# EAGLE design simpleclock_v1 (EAGLE 6.4)
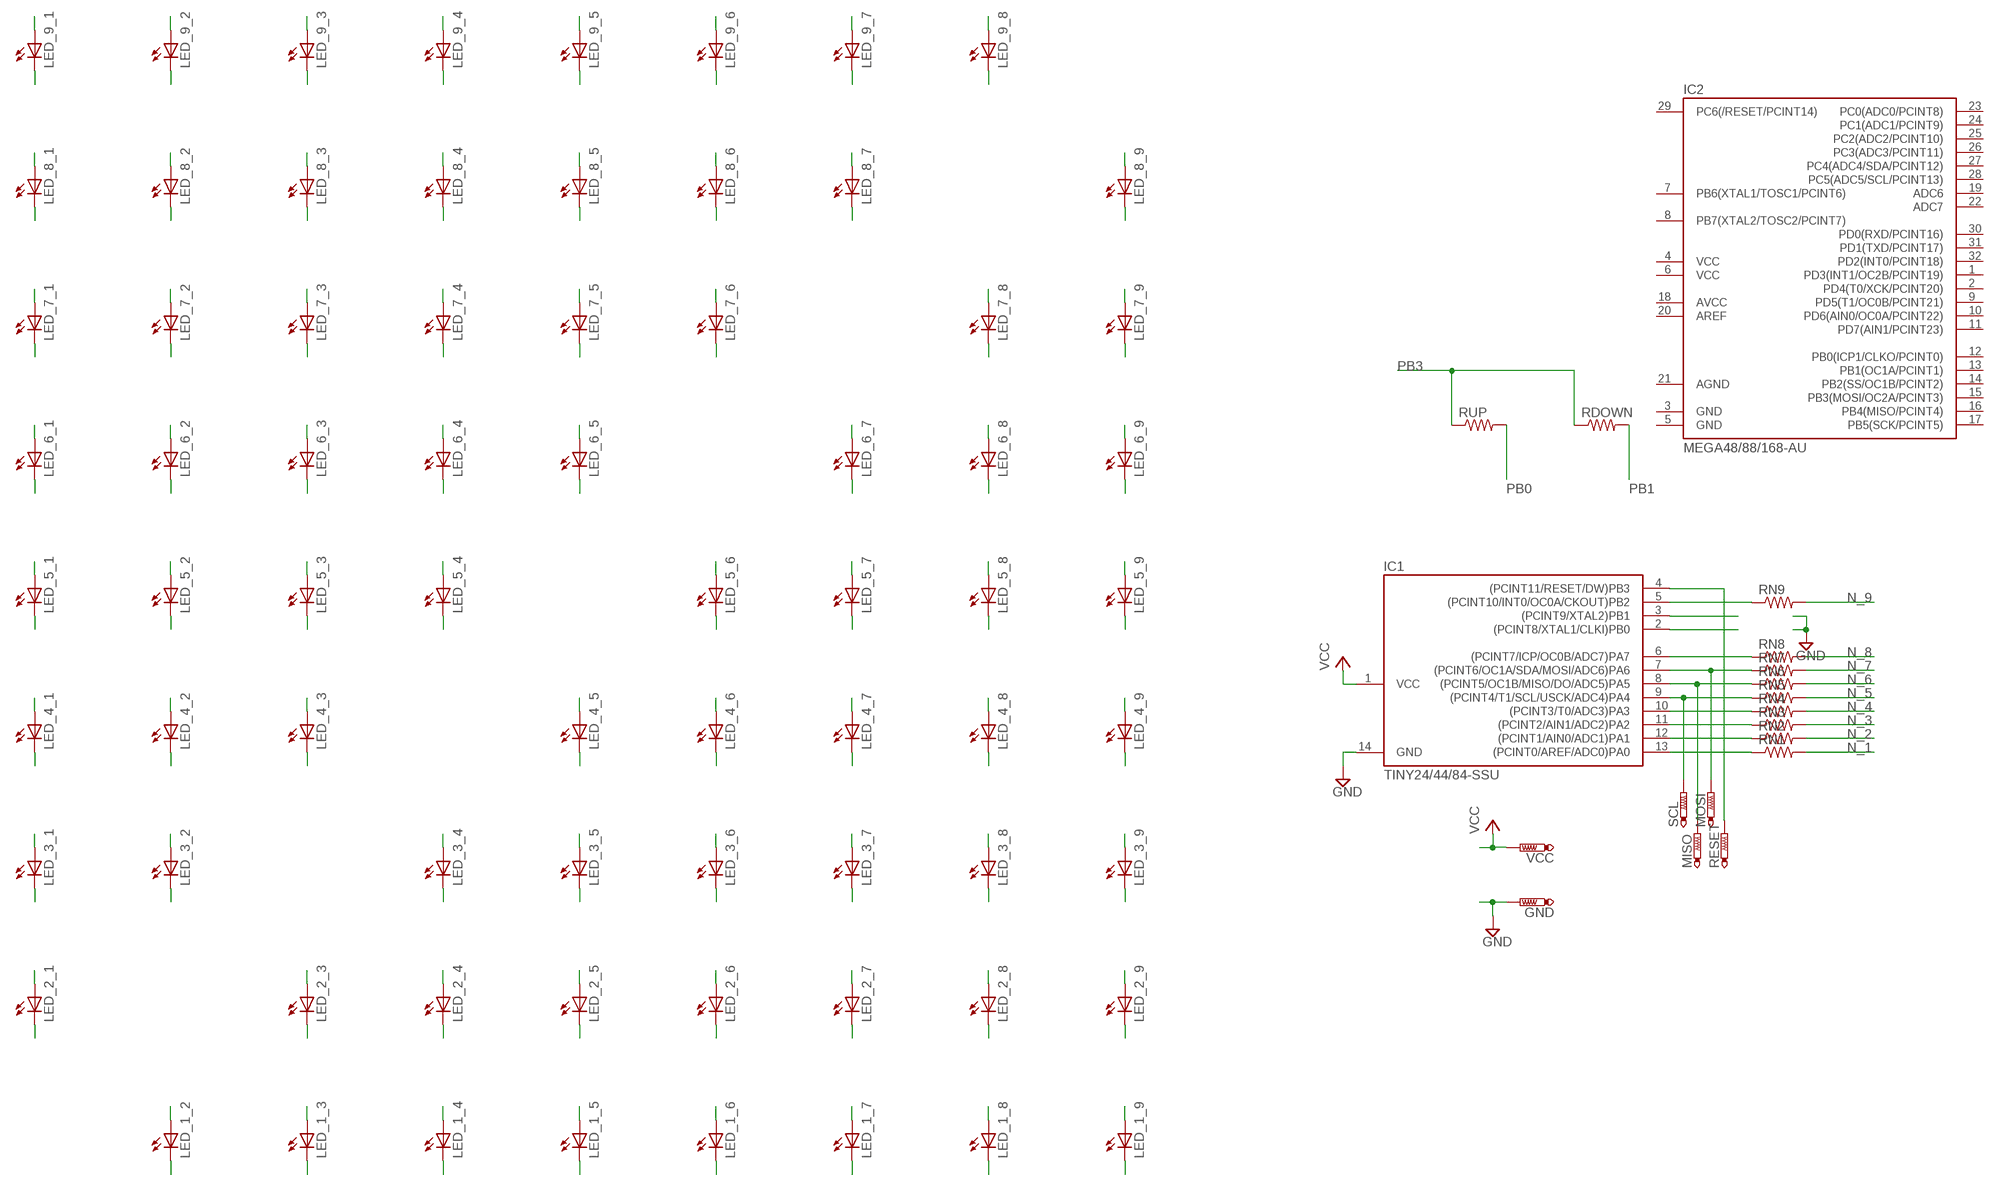
[diagram p0: schematic, sheet 1]

## Parts
GND  PTR1PAD1-13  [P1-13]
IC1  TINY24/44/84-SSU  [SOIC14]
IC2  MEGA48/88/168-AU  [TQFP32-08]
LED_1_2  LEDCHIPLED_1206  [CHIPLED_1206]
LED_1_3  LEDCHIPLED_1206  [CHIPLED_1206]
LED_1_4  LEDCHIPLED_1206  [CHIPLED_1206]
LED_1_5  LEDCHIPLED_1206  [CHIPLED_1206]
LED_1_6  LEDCHIPLED_1206  [CHIPLED_1206]
LED_1_7  LEDCHIPLED_1206  [CHIPLED_1206]
LED_1_8  LEDCHIPLED_1206  [CHIPLED_1206]
LED_1_9  LEDCHIPLED_1206  [CHIPLED_1206]
LED_2_1  LEDCHIPLED_1206  [CHIPLED_1206]
LED_2_3  LEDCHIPLED_1206  [CHIPLED_1206]
LED_2_4  LEDCHIPLED_1206  [CHIPLED_1206]
LED_2_5  LEDCHIPLED_1206  [CHIPLED_1206]
LED_2_6  LEDCHIPLED_1206  [CHIPLED_1206]
LED_2_7  LEDCHIPLED_1206  [CHIPLED_1206]
LED_2_8  LEDCHIPLED_1206  [CHIPLED_1206]
LED_2_9  LEDCHIPLED_1206  [CHIPLED_1206]
LED_3_1  LEDCHIPLED_1206  [CHIPLED_1206]
LED_3_2  LEDCHIPLED_1206  [CHIPLED_1206]
LED_3_4  LEDCHIPLED_1206  [CHIPLED_1206]
LED_3_5  LEDCHIPLED_1206  [CHIPLED_1206]
LED_3_6  LEDCHIPLED_1206  [CHIPLED_1206]
LED_3_7  LEDCHIPLED_1206  [CHIPLED_1206]
LED_3_8  LEDCHIPLED_1206  [CHIPLED_1206]
LED_3_9  LEDCHIPLED_1206  [CHIPLED_1206]
LED_4_1  LEDCHIPLED_1206  [CHIPLED_1206]
LED_4_2  LEDCHIPLED_1206  [CHIPLED_1206]
LED_4_3  LEDCHIPLED_1206  [CHIPLED_1206]
LED_4_5  LEDCHIPLED_1206  [CHIPLED_1206]
LED_4_6  LEDCHIPLED_1206  [CHIPLED_1206]
LED_4_7  LEDCHIPLED_1206  [CHIPLED_1206]
LED_4_8  LEDCHIPLED_1206  [CHIPLED_1206]
LED_4_9  LEDCHIPLED_1206  [CHIPLED_1206]
LED_5_1  LEDCHIPLED_1206  [CHIPLED_1206]
LED_5_2  LEDCHIPLED_1206  [CHIPLED_1206]
LED_5_3  LEDCHIPLED_1206  [CHIPLED_1206]
LED_5_4  LEDCHIPLED_1206  [CHIPLED_1206]
LED_5_6  LEDCHIPLED_1206  [CHIPLED_1206]
LED_5_7  LEDCHIPLED_1206  [CHIPLED_1206]
LED_5_8  LEDCHIPLED_1206  [CHIPLED_1206]
LED_5_9  LEDCHIPLED_1206  [CHIPLED_1206]
LED_6_1  LEDCHIPLED_1206  [CHIPLED_1206]
LED_6_2  LEDCHIPLED_1206  [CHIPLED_1206]
LED_6_3  LEDCHIPLED_1206  [CHIPLED_1206]
LED_6_4  LEDCHIPLED_1206  [CHIPLED_1206]
LED_6_5  LEDCHIPLED_1206  [CHIPLED_1206]
LED_6_7  LEDCHIPLED_1206  [CHIPLED_1206]
LED_6_8  LEDCHIPLED_1206  [CHIPLED_1206]
LED_6_9  LEDCHIPLED_1206  [CHIPLED_1206]
LED_7_1  LEDCHIPLED_1206  [CHIPLED_1206]
LED_7_2  LEDCHIPLED_1206  [CHIPLED_1206]
LED_7_3  LEDCHIPLED_1206  [CHIPLED_1206]
LED_7_4  LEDCHIPLED_1206  [CHIPLED_1206]
LED_7_5  LEDCHIPLED_1206  [CHIPLED_1206]
LED_7_6  LEDCHIPLED_1206  [CHIPLED_1206]
LED_7_8  LEDCHIPLED_1206  [CHIPLED_1206]
LED_7_9  LEDCHIPLED_1206  [CHIPLED_1206]
LED_8_1  LEDCHIPLED_1206  [CHIPLED_1206]
LED_8_2  LEDCHIPLED_1206  [CHIPLED_1206]
LED_8_3  LEDCHIPLED_1206  [CHIPLED_1206]
LED_8_4  LEDCHIPLED_1206  [CHIPLED_1206]
LED_8_5  LEDCHIPLED_1206  [CHIPLED_1206]
LED_8_6  LEDCHIPLED_1206  [CHIPLED_1206]
LED_8_7  LEDCHIPLED_1206  [CHIPLED_1206]
LED_8_9  LEDCHIPLED_1206  [CHIPLED_1206]
LED_9_1  LEDCHIPLED_1206  [CHIPLED_1206]
LED_9_2  LEDCHIPLED_1206  [CHIPLED_1206]
LED_9_3  LEDCHIPLED_1206  [CHIPLED_1206]
LED_9_4  LEDCHIPLED_1206  [CHIPLED_1206]
LED_9_5  LEDCHIPLED_1206  [CHIPLED_1206]
LED_9_6  LEDCHIPLED_1206  [CHIPLED_1206]
LED_9_7  LEDCHIPLED_1206  [CHIPLED_1206]
LED_9_8  LEDCHIPLED_1206  [CHIPLED_1206]
MISO  PTR1PAD1-13  [P1-13]
MOSI  PTR1PAD1-13  [P1-13]
RDOWN  RESISTOR1206  [1206]
RESET  PTR1PAD1-13  [P1-13]
RN1  RESISTOR1206  [1206]
RN2  RESISTOR1206  [1206]
RN3  RESISTOR1206  [1206]
RN4  RESISTOR1206  [1206]
RN5  RESISTOR1206  [1206]
RN6  RESISTOR1206  [1206]
RN7  RESISTOR1206  [1206]
RN8  RESISTOR1206  [1206]
RN9  RESISTOR1206  [1206]
RUP  RESISTOR1206  [1206]
SCL  PTR1PAD1-13  [P1-13]
VCC  PTR1PAD1-13  [P1-13]

## Nets
GND: GND.TP IC1.14(GND)
N_1: LED_1_2.A LED_1_3.A LED_1_4.A LED_1_5.A LED_1_6.A LED_1_7.A LED_1_8.A LED_1_9.A LED_2_1.C LED_3_1.C LED_4_1.C LED_5_1.C LED_6_1.C LED_7_1.C LED_8_1.C LED_9_1.C RN1.2
N_2: LED_1_2.C LED_2_1.A LED_2_3.A LED_2_4.A LED_2_5.A LED_2_6.A LED_2_7.A LED_2_8.A LED_2_9.A LED_3_2.C LED_4_2.C LED_5_2.C LED_6_2.C LED_7_2.C LED_8_2.C LED_9_2.C RN2.2
N_3: LED_1_3.C LED_2_3.C LED_3_1.A LED_3_2.A LED_3_4.A LED_3_5.A LED_3_6.A LED_3_7.A LED_3_8.A LED_3_9.A LED_4_3.C LED_5_3.C LED_6_3.C LED_7_3.C LED_8_3.C LED_9_3.C RN3.2
N_4: LED_1_4.C LED_2_4.C LED_3_4.C LED_4_1.A LED_4_2.A LED_4_3.A LED_4_5.A LED_4_6.A LED_4_7.A LED_4_8.A LED_4_9.A LED_5_4.C LED_6_4.C LED_7_4.C LED_8_4.C LED_9_4.C RN4.2
N_5: LED_1_5.C LED_2_5.C LED_3_5.C LED_4_5.C LED_5_1.A LED_5_2.A LED_5_3.A LED_5_4.A LED_5_6.A LED_5_7.A LED_5_8.A LED_5_9.A LED_6_5.C LED_7_5.C LED_8_5.C LED_9_5.C RN5.2
N_6: LED_1_6.C LED_2_6.C LED_3_6.C LED_4_6.C LED_5_6.C LED_6_1.A LED_6_2.A LED_6_3.A LED_6_4.A LED_6_5.A LED_6_7.A LED_6_8.A LED_6_9.A LED_7_6.C LED_8_6.C LED_9_6.C RN6.2
N_7: LED_1_7.C LED_2_7.C LED_3_7.C LED_4_7.C LED_5_7.C LED_6_7.C LED_7_1.A LED_7_2.A LED_7_3.A LED_7_4.A LED_7_5.A LED_7_6.A LED_7_8.A LED_7_9.A LED_8_7.C LED_9_7.C RN7.2
N_8: LED_1_8.C LED_2_8.C LED_3_8.C LED_4_8.C LED_5_8.C LED_6_8.C LED_7_8.C LED_8_1.A LED_8_2.A LED_8_3.A LED_8_4.A LED_8_5.A LED_8_6.A LED_8_7.A LED_8_9.A LED_9_8.C RN8.2
N_9: LED_1_9.C LED_2_9.C LED_3_9.C LED_4_9.C LED_5_9.C LED_6_9.C LED_7_9.C LED_8_9.C LED_9_1.A LED_9_2.A LED_9_3.A LED_9_4.A LED_9_5.A LED_9_6.A LED_9_7.A LED_9_8.A RN9.2
PA0: IC1.13((PCINT0/AREF/ADC0)PA0) RN1.1
PA1: IC1.12((PCINT1/AIN0/ADC1)PA1) RN2.1
PA2: IC1.11((PCINT2/AIN1/ADC2)PA2) RN3.1
PA3: IC1.10((PCINT3/T0/ADC3)PA3) RN4.1
PA4: IC1.9((PCINT4/T1/SCL/USCK/ADC4)PA4) RN5.1 SCL.TP
PA5: IC1.8((PCINT5/OC1B/MISO/DO/ADC5)PA5) MISO.TP RN6.1
PA6: IC1.7((PCINT6/OC1A/SDA/MOSI/ADC6)PA6) MOSI.TP RN7.1
PA7: IC1.6((PCINT7/ICP/OC0B/ADC7)PA7) RN8.1
PB0: IC1.2((PCINT8/XTAL1/CLKI)PB0) RUP.2
PB1: IC1.3((PCINT9/XTAL2)PB1) RDOWN.2
PB2: IC1.5((PCINT10/INT0/OC0A/CKOUT)PB2) RN9.1
PB3: IC1.4((PCINT11/RESET/DW)PB3) RDOWN.1 RESET.TP RUP.1
VCC: IC1.1(VCC) VCC.TP
Unconnected: IC2.1(PD3(INT1/OC2B/PCINT19)) IC2.2(PD4(T0/XCK/PCINT20)) IC2.7(PB6(XTAL1/TOSC1/PCINT6)) IC2.8(PB7(XTAL2/TOSC2/PCINT7)) IC2.9(PD5(T1/OC0B/PCINT21)) IC2.10(PD6(AIN0/OC0A/PCINT22)) IC2.11(PD7(AIN1/PCINT23)) IC2.12(PB0(ICP1/CLKO/PCINT0)) IC2.13(PB1(OC1A/PCINT1)) IC2.14(PB2(SS/OC1B/PCINT2)) IC2.15(PB3(MOSI/OC2A/PCINT3)) IC2.16(PB4(MISO/PCINT4)) IC2.17(PB5(SCK/PCINT5)) IC2.18(AVCC) IC2.19(ADC6) IC2.20(AREF) IC2.22(ADC7) IC2.23(PC0(ADC0/PCINT8)) IC2.24(PC1(ADC1/PCINT9)) IC2.25(PC2(ADC2/PCINT10)) IC2.26(PC3(ADC3/PCINT11)) IC2.27(PC4(ADC4/SDA/PCINT12)) IC2.28(PC5(ADC5/SCL/PCINT13)) IC2.29(PC6(/RESET/PCINT14)) IC2.30(PD0(RXD/PCINT16)) IC2.31(PD1(TXD/PCINT17)) IC2.32(PD2(INT0/PCINT18))

## Power pins joined to a net without a drawn wire
AGND: IC2.21(AGND)
GND: IC2.3(GND) IC2.5(GND)
VCC: IC2.4(VCC) IC2.6(VCC)

## Library data of the parts
GND MISO MOSI RESET SCL VCC = testpad:PTR1: TEST PIN
IC1 = avr-7:TINY24/44/84
IC2 = avr-7:MEGA48/88/168
LED_1_2-LED_1_9 LED_2_1 LED_2_3-LED_2_9 LED_3_1 LED_3_2 LED_3_4-LED_3_9 LED_4_1-LED_4_3 LED_4_5-LED_4_9 LED_5_1-LED_5_4 LED_5_6-LED_5_9 LED_6_1-LED_6_5 LED_6_7-LED_6_9 LED_7_1-LED_7_6 LED_7_8 LED_7_9 LED_8_1-LED_8_7 LED_8_9 LED_9_1-LED_9_8 = led:LED: LED OSRAM: - CHIPLED LG R971, LG N971, LY N971, LG Q971, LY Q971, LO R971, LY R971 LH N974, LH R974 LS Q976, LO Q976, LY Q976 LO Q996 - Hyper CHIPLED LW Q18S LB Q993, LB Q99A, LB R99A - SideLED LS A670, LO A670, LY A670, LG A670, LP A670 LB A673, LV A673, LT A673, LW A673 LH A674 LY A675 LS A676, LA A676, LO A676, LY A676, LW A676 LS A679, LY A679, LG A679 - Hyper Micro SIDELED® LS Y876, LA Y876, LO Y876, LY Y876 LT Y87S - SmartLED LW L88C, LW L88S LB L89C, LB L89S, LG L890 LS L89K, LO L89K, LY L89K LS L896, LA L896, LO L896, LY L896 - TOPLED LS T670, LO T670, LY T670, LG T670, LP T670 LSG T670, LSP T670, LSY T670, LOP T670, LYG T670 LG T671, LOG T671, LSG T671 LB T673, LV T673, LT T673, LW T673 LH T674 LS T676, LA T676, LO T676, LY T676, LB T676, LH T676, LSB T676, LW T676 LB T67C, LV T67C, LT T67C, LS T67K, LO T67K, LY T67K, LW E67C LS E67B, LA E67B, LO E67B, LY E67B, LB E67C, LV E67C, LT E67C LW T67C LS T679, LY T679, LG T679 LS T770, LO T770, LY T770, LG T770, LP T770 LB T773, LV T773, LT T773, LW T773 LH T774 LS E675, LA E675, LY E675, LS T675 LS T776, LA T776, LO T776, LY T776, LB T776 LHGB T686 LT T68C, LB T68C - Hyper Mini TOPLED® LB M676 - Mini TOPLED Santana® LG M470 LS M47K, LO M47K, LY M47K Source: http://www.osram.convergy.de LUXEON: - LUMILED® LXK2-PW12-R00, LXK2-PW12-S00, LXK2-PW14-U00, LXK2-PW14-V00 LXK2-PM12-R00, LXK2-PM12-S00, LXK2-PM14-U00 LXK2-PE12-Q00, LXK2-PE12-R00, LXK2-PE12-S00, LXK2-PE14-T00, LXK2-PE14-U00 LXK2-PB12-K00, LXK2-PB12-L00, LXK2-PB12-M00, LXK2-PB14-N00, LXK2-PB14-P00, LXK2-PB14-Q00 LXK2-PR12-L00, LXK2-PR12-M00, LXK2-PR14-Q00, LXK2-PR14-R00 LXK2-PD12-Q00, LXK2-PD12-R00, LXK2-PD12-S00 LXK2-PH12-R00, LXK2-PH12-S00 LXK2-PL12-P00, LXK2-PL12-Q00, LXK2-PL12-R00 Source: www.luxeon.com KINGBRIGHT: KA-3528ASYC Source: www.kingbright.com
RDOWN RN1-RN9 RUP = SparkFun:RESISTOR: Resistor Basic schematic elements and footprints for 0603, 1206, and PTH resistors.

## Board
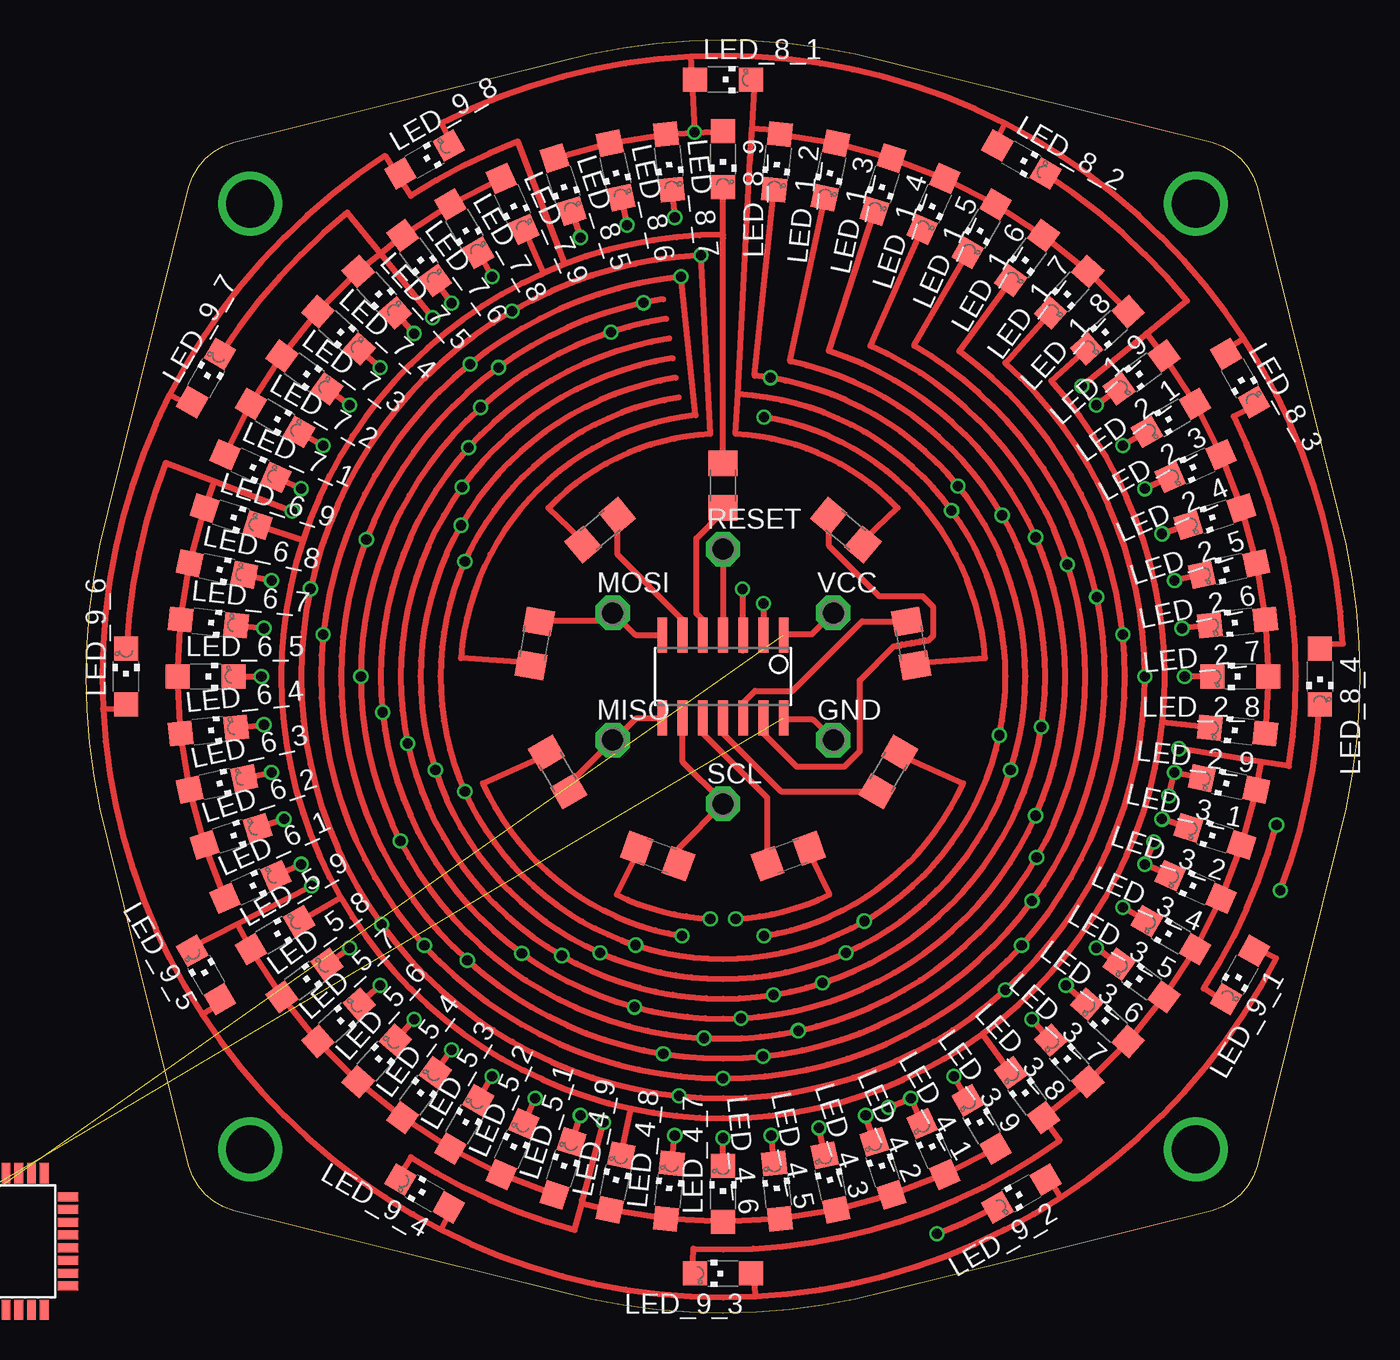
[diagram p1: board, top side]
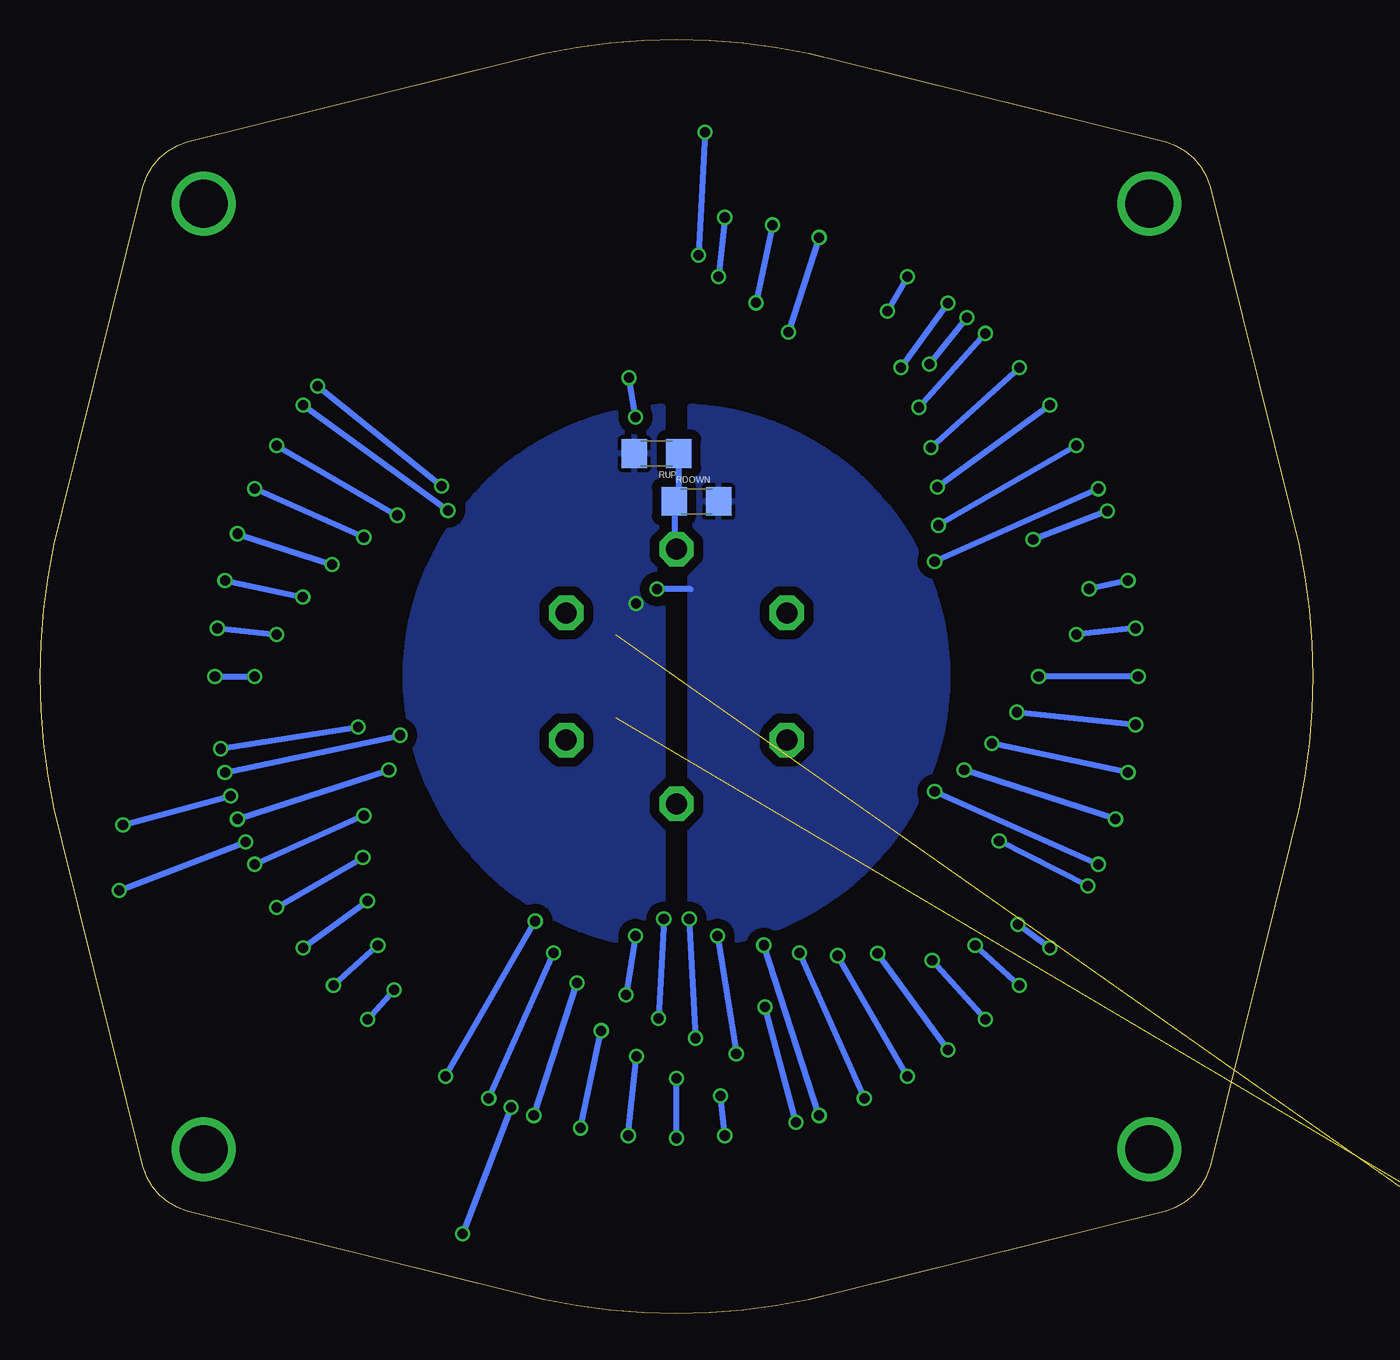
[diagram p2: board, bottom side, seen from below]

Size 80 x 80 mm. Coordinates in mm from the lower left corner, seen from the top.
Outline: 0,40 0.06,42.09 0.22,44.18 0.49,46.26 0.87,48.32 1.36,50.35 6.44,70.73 6.68,71.39 7.03,71.99 7.47,72.53 8.01,72.97 8.61,73.32 9.27,73.56 29.65,78.64 31.68,79.13 33.74,79.51 35.82,79.78 37.91,79.94 40,80 42.09,79.94 44.18,79.78 46.26,79.51 48.32,79.13 50.35,78.64 70.73,73.56 71.39,73.32 71.99,72.97 72.53,72.53 72.97,71.99 73.32,71.39 73.56,70.73 78.64,50.35 79.13,48.32 79.51,46.26 79.78,44.18 79.94,42.09 80,40 79.94,37.91 79.78,35.82 79.51,33.74 79.13,31.68 78.64,29.65 73.56,9.27 73.32,8.61 72.97,8.01 72.53,7.47 71.99,7.03 71.39,6.68 70.73,6.44 50.35,1.36 48.32,0.87 46.26,0.49 44.18,0.22 42.09,0.06 40,0 37.91,0.06 35.82,0.22 33.74,0.49 31.68,0.87 29.65,1.36 9.27,6.44 8.61,6.68 8.01,7.03 7.47,7.47 7.03,8.01 6.68,8.61 6.44,9.27 1.36,29.65 0.87,31.68 0.49,33.74 0.22,35.82 0.06,37.91 0,40
Copper layers (1*16): Top 0.035mm / dielectric 1.5mm / Bottom 0.035mm
Design rules "Fusion_eagle_rule_v1.1 *": minimum track width 15mil, minimum drill 25mil, track to track 15mil, track to pad 15mil, pad to pad 15mil, via to via 15mil, smd to smd 15mil, copper to edge 15mil, drill to drill 15mil, minimum pad ring 10mil, minimum via ring 6mil, stop-mask expansion 2mil, vias tented up to drill 100mil, thermal gap 10mil

### Footprints (pad centres in the part's own frame; a part is rotated, then mirrored left to right if it is on the bottom)
P1-13 = drill 1.321 pad 2.159 octagon: TP 0,0
SOIC14 = smd 0.61 x 2.21: 1 -3.81,-2.603; 2 -2.54,-2.603; 3 -1.27,-2.603; 4 0,-2.603; 5 1.27,-2.603; 6 2.54,-2.603; 7 3.81,-2.603; 8 3.81,2.603; 9 2.54,2.603; 10 1.27,2.603; 11 0,2.603; 12 -1.27,2.603; 13 -2.54,2.603; 14 -3.81,2.603
TQFP32-08 = smd 1.27 x 0.559: 1 -4.293,2.8; 2 -4.293,2; 3 -4.293,1.2; 4 -4.293,0.4; 5 -4.293,-0.4; 6 -4.293,-1.2; 7 -4.293,-2; 8 -4.293,-2.8; 17 4.293,-2.8; 18 4.293,-2; 19 4.293,-1.2; 20 4.293,-0.4; 21 4.293,0.4; 22 4.293,1.2; 23 4.293,2; 24 4.293,2.8 | smd 0.559 x 1.27: 9 -2.8,-4.293; 10 -2,-4.293; 11 -1.2,-4.293; 12 -0.4,-4.293; 13 0.4,-4.293; 14 1.2,-4.293; 15 2,-4.293; 16 2.8,-4.293; 25 2.8,4.293; 26 2,4.293; 27 1.2,4.293; 28 0.4,4.293; 29 -0.4,4.293; 30 -1.2,4.293; 31 -2,4.293; 32 -2.8,4.293
CHIPLED_1206 = smd 1.5 x 1.5: A 0,-1.75; C 0,1.75
1206 = smd 1.6 x 1.8: 1 -1.4,0; 2 1.4,0

### Placement (x,y rotation side)
GND  46.93,36 0 top
IC1  40,40 180 top
IC2  -5.44,4.52 0 top
LED_1_2  43.4,72.32 174 top
LED_1_3  46.76,71.79 168 top
LED_1_4  50.04,70.91 162 top
LED_1_5  53.22,69.69 156 top
LED_1_6  56.25,68.15 150 top
LED_1_7  59.1,66.29 144 top
LED_1_8  61.75,64.15 138 top
LED_1_9  64.15,61.75 132 top
LED_2_1  66.29,59.1 126 top
LED_2_3  68.15,56.25 120 top
LED_2_4  69.69,53.22 114 top
LED_2_5  70.91,50.04 108 top
LED_2_6  71.79,46.76 102 top
LED_2_7  72.32,43.4 96 top
LED_2_8  72.5,40 90 top
LED_2_9  72.32,36.6 84 top
LED_3_1  71.79,33.24 78 top
LED_3_2  70.91,29.96 72 top
LED_3_4  69.69,26.78 66 top
LED_3_5  68.15,23.75 60 top
LED_3_6  66.29,20.9 54 top
LED_3_7  64.15,18.25 48 top
LED_3_8  61.75,15.85 42 top
LED_3_9  59.1,13.71 36 top
LED_4_1  56.25,11.85 30 top
LED_4_2  53.22,10.31 24 top
LED_4_3  50.04,9.09 18 top
LED_4_5  46.76,8.21 12 top
LED_4_6  43.4,7.68 6 top
LED_4_7  40,7.5 0 top
LED_4_8  36.6,7.68 354 top
LED_4_9  33.24,8.21 348 top
LED_5_1  29.96,9.09 342 top
LED_5_2  26.78,10.31 336 top
LED_5_3  23.75,11.85 330 top
LED_5_4  20.9,13.71 324 top
LED_5_6  18.25,15.85 318 top
LED_5_7  15.85,18.25 312 top
LED_5_8  13.71,20.9 306 top
LED_5_9  11.85,23.75 300 top
LED_6_1  10.31,26.78 294 top
LED_6_2  9.09,29.96 288 top
LED_6_3  8.21,33.24 282 top
LED_6_4  7.68,36.6 276 top
LED_6_5  7.5,40 270 top
LED_6_7  7.68,43.4 264 top
LED_6_8  8.21,46.76 258 top
LED_6_9  9.09,50.04 252 top
LED_7_1  10.31,53.22 246 top
LED_7_2  11.85,56.25 240 top
LED_7_3  13.71,59.1 234 top
LED_7_4  15.85,61.75 228 top
LED_7_5  18.25,64.15 222 top
LED_7_6  20.9,66.29 216 top
LED_7_8  23.75,68.15 210 top
LED_7_9  26.78,69.69 204 top
LED_8_1  40,77.5 270 top
LED_8_2  58.75,72.48 240 top
LED_8_3  72.48,58.75 210 top
LED_8_4  77.5,40 180 top
LED_8_5  29.96,70.91 198 top
LED_8_6  33.24,71.79 192 top
LED_8_7  36.6,72.32 186 top
LED_8_9  40,72.5 180 top
LED_9_1  72.48,21.25 150 top
LED_9_2  58.75,7.52 120 top
LED_9_3  40,2.5 90 top
LED_9_4  21.25,7.52 60 top
LED_9_5  7.52,21.25 30 top
LED_9_6  2.5,40 0 top
LED_9_7  7.52,58.75 330 top
LED_9_8  21.25,72.48 300 top
MISO  33.07,36 0 top
MOSI  33.07,44 0 top
RDOWN  38.75,51 0 bottom
RESET  40,48 0 top
RN1  47.71,49.19 320 top
RN2  51.82,42.08 280 top
RN3  50.39,34 60 top
RN4  44.1,28.72 20 top
RN5  35.9,28.72 160 top
RN6  29.61,34 120 top
RN7  28.18,42.08 260 top
RN8  32.29,49.19 220 top
RN9  40,52 90 top
RUP  41.25,54 180 bottom
SCL  40,32 0 top
VCC  46.93,44 0 top

### Tracks (layer width: path | path; a pad name or v marks a point on that pad's centre or on a via)
GND  (2 unrouted)
  Top 0.381: 43.81,37.41 IC1.14 43.97,37.29 45.64,37.29 46.91,36.02 GND.TP
N$1  (via drill 3)
  other vias: 10.3,10.3
N$2  (via drill 3)
  other vias: 10.3,69.7
N$3  (via drill 3)
  other vias: 69.7,69.7
N$4  (via drill 3)
  other vias: 69.7,10.3
N_1  (via drill 0.64)
  Top 0.381: LED_1_3.A LED_1_2.A 43.66,74.12 43.61,74.31 41.81,74.45 41.7,72.45 | LED_1_3.A | LED_1_3.A 47.14,73.5 | 47.14,73.5 LED_1_4.A LED_1_5.A | LED_1_5.A LED_1_6.A LED_1_7.A LED_1_8.A LED_1_9.A | 37.22,57.53 36.31,57.36 35.41,57.15 34.52,56.88 33.64,56.57 32.78,56.22 31.94,55.81 31.12,55.37 30.33,54.89 29.57,54.36 28.83,53.79 28.12,53.19 27.45,52.55 26.81,51.88 26.21,51.17 25.64,50.43 25.11,49.67 24.63,48.88 24.18,48.06 v23.79,47.22 23.43,46.36 23.12,45.48 22.86,44.59 22.64,43.69 22.47,42.78 22.35,41.85 22.27,40.93 22.25,40 22.27,39.07 22.35,38.15 22.47,37.22 22.64,36.31 22.86,35.41 23.12,34.52 23.43,33.64 v23.79,32.78 24.18,31.94 24.63,31.12 25.11,30.33 25.64,29.57 26.21,28.83 26.81,28.12 27.45,27.45 28.12,26.81 28.83,26.21 29.57,25.64 30.33,25.11 31.12,24.63 31.94,24.18 32.78,23.79 33.64,23.43 v34.52,23.12 35.41,22.86 36.31,22.64 37.22,22.47 38.15,22.35 39.07,22.27 40,22.25 40.93,22.27 41.85,22.35 42.78,22.47 43.69,22.64 44.59,22.86 45.48,23.12 46.36,23.43 47.22,23.79 48.06,24.18 v48.88,24.63 49.67,25.11 50.43,25.64 51.17,26.21 51.88,26.81 52.55,27.45 53.19,28.12 53.79,28.83 54.36,29.57 54.89,30.33 55.37,31.12 55.81,31.94 56.22,32.78 56.57,33.64 56.88,34.52 57.15,35.41 v57.36,36.31 57.53,37.22 57.65,38.15 57.73,39.07 57.75,40 57.73,40.93 57.65,41.85 57.53,42.78 57.36,43.69 57.15,44.59 56.88,45.48 56.57,46.36 56.22,47.22 55.81,48.06 55.37,48.88 54.89,49.67 v54.36,50.43 53.79,51.17 53.19,51.88 52.55,52.55 51.88,53.19 51.17,53.79 50.43,54.36 49.67,54.89 48.88,55.37 48.06,55.81 47.22,56.22 46.36,56.57 45.48,56.88 44.59,57.15 43.69,57.36 42.78,57.53 41.85,57.65 40.93,57.73
  Top 0.381: 40.93,57.73 41.7,72.45 | 40.93,57.73 40.8,55.23 41.56,55.17 42.31,55.07 43.07,54.94 43.81,54.77 44.54,54.56 45.27,54.31 45.98,54.03 46.67,53.71 47.35,53.36 48.01,52.98 48.65,52.56 49.26,52.12 49.86,51.64 50.43,51.13 50.97,50.59 48.99,48.68 49,48.51 48.79,48.31 RN1.2 | 41.7,72.45 41.96,77.45 41.78,77.52 41.76,77.52 LED_8_1.C | v74.77,30.68 74.24,28.88 73.61,27.1 72.89,25.36 72.08,23.66 71.18,22 70.19,20.39 71.45,19.58 71.58,19.71 LED_9_1.C | v68.01,32.49 v68.37,33.97 LED_3_1.C | LED_2_1.C v63.46,57.05 | LED_3_1.C | LED_3_1.C | LED_4_1.C v54.5,14.88 | LED_5_1.C | LED_5_1.C | LED_5_1.C v31.04,12.42 | LED_6_1.C | LED_6_1.C | LED_6_1.C v13.51,28.2 | LED_7_1.C | LED_7_1.C | LED_7_1.C v13.51,51.8 | LED_1_3.A 47.14,73.51 47.14,73.5 | LED_6_1.C 11.91,27.51 LED_6_1.C | LED_7_1.C | LED_5_1.C | LED_3_1.C 70.08,33.63 LED_3_1.C | LED_1_5.A | 53.95,71.3 LED_1_5.A
  Bottom 0.381: v63.46,57.05 v54.36,50.43 | v68.37,33.97 v57.36,36.31 | v54.5,14.88 v48.88,24.63 | v31.04,12.42 v34.52,23.12 | v13.51,28.2 v23.79,32.78 | v13.51,51.8 v23.79,47.22 | v74.77,30.68 v68.01,32.49
N_2  (via drill 0.64)
  Top 0.381: LED_2_4.A LED_2_3.A LED_2_1.A 66.62,61.55 | LED_2_4.A LED_2_5.A 73.5,47.14 | 73.5,47.14 LED_2_6.A | LED_2_6.A | LED_2_6.A LED_2_7.A | LED_2_7.A | LED_2_7.A | LED_2_7.A LED_2_8.A LED_2_9.A | 37.03,58.77 36.05,58.59 35.08,58.35 34.13,58.07 33.19,57.74 32.27,57.36 31.37,56.93 30.5,56.45 29.65,55.94 28.83,55.37 28.04,54.77 27.29,54.12 26.57,53.44 25.88,52.71 25.23,51.96 24.63,51.17 24.07,50.35 v23.55,49.5 23.07,48.63 22.64,47.73 22.26,46.81 21.93,45.87 21.65,44.92 21.41,43.95 21.23,42.97 21.1,41.99 21.03,40.99 21,40 21.03,39.01 21.1,38.01 21.23,37.03 21.41,36.05 21.65,35.08 v21.93,34.13 22.26,33.19 22.64,32.27 23.07,31.37 23.55,30.5 24.07,29.65 24.63,28.83 25.23,28.04 25.88,27.29 26.57,26.57 27.29,25.88 28.04,25.23 28.83,24.63 29.65,24.07 30.5,23.55 31.37,23.07 v32.27,22.64 33.19,22.26 34.13,21.93 35.08,21.65 36.05,21.41 37.03,21.23 38.01,21.1 39.01,21.03 40,21 40.99,21.03 41.99,21.1 42.97,21.23 43.95,21.41 44.92,21.65 45.87,21.93 46.81,22.26 v47.73,22.64 48.63,23.07 49.5,23.55 50.35,24.07 51.17,24.63 51.96,25.23 52.71,25.88 53.44,26.57 54.12,27.29 54.77,28.04 55.37,28.83 55.94,29.65 56.45,30.5 56.93,31.37 57.36,32.27 57.74,33.19 v58.07,34.13 58.35,35.08 58.59,36.05 58.77,37.03 58.9,38.01 58.97,39.01 59,40 58.97,40.99 58.9,41.99 58.77,42.97 58.59,43.95 58.35,44.92 58.07,45.87 57.74,46.81 57.36,47.73 56.93,48.63 56.45,49.5 55.94,50.35 55.37,51.17 v54.77,51.96 54.12,52.71 53.44,53.44 52.71,54.12 51.96,54.77 51.17,55.37 50.35,55.94 49.5,56.45 48.63,56.93 47.73,57.36 46.81,57.74 45.87,58.07 44.92,58.35 43.95,58.59 v42.97,58.77 41.99,58.9 LED_1_2.C
  Top 0.381: v42.58,56.3 43.42,56.14 44.25,55.94 45.07,55.7 45.87,55.42 46.66,55.1 47.43,54.73 48.18,54.33 48.91,53.89 49.62,53.41 50.3,52.89 50.95,52.34 51.57,51.76 52.16,51.15 52.73,50.5 53.25,49.83 53.74,49.13 54.19,48.41 54.61,47.67 54.99,46.9 55.32,46.12 55.62,45.32 55.87,44.51 56.09,43.68 56.25,42.84 56.38,42 56.46,41.15 52.47,40.87 52.38,40.72 RN2.2 | 66.62,61.55 69.14,63.6 67.87,65.09 66.52,66.52 65.09,67.87 63.6,69.14 62.04,70.34 60.42,71.45 60.3,71.6 LED_8_2.C | 66.62,61.55 v62.54,58.25 | v53.44,4.99 55.25,5.74 57.02,6.59 57.2,6.66 LED_9_2.C | v50.39,12.93 v51.8,13.51 LED_4_2.C | LED_3_2.C v67.58,31.04 | LED_4_2.C | LED_4_2.C | LED_5_2.C | LED_5_2.C | LED_5_2.C v28.2,13.51 | LED_6_2.C | LED_6_2.C | LED_6_2.C v12.42,31.04 | LED_7_2.C v14.88,54.5 | LED_5_2.C 27.51,11.91 LED_5_2.C | LED_6_2.C | LED_4_2.C | LED_3_2.C | 69.27,30.5 LED_3_2.C | LED_2_7.A | LED_2_6.A 73.51,47.14 73.5,47.14 | LED_2_4.A | LED_2_4.A
  Bottom 0.381: v67.58,31.04 v58.07,34.13 | v51.8,13.51 v47.73,22.64 | v28.2,13.51 v32.27,22.64 | v12.42,31.04 v21.93,34.13 | v14.88,54.5 v23.55,49.5 | v62.54,58.25 v54.77,51.96 | v50.39,12.93 v53.44,4.99 | v42.58,56.3 v42.97,58.77
N_3  (via drill 0.64)
  Top 0.381: LED_3_1.A LED_3_2.A | LED_3_2.A LED_3_4.A LED_3_5.A LED_3_6.A | LED_3_6.A LED_3_7.A | LED_3_7.A LED_3_8.A | LED_3_8.A LED_3_9.A | 36.83,60 35.79,59.81 34.76,59.56 33.74,59.26 32.74,58.91 31.76,58.5 30.81,58.04 29.88,57.54 28.97,56.98 28.1,56.38 27.26,55.74 26.45,55.05 25.68,54.32 24.95,53.55 24.26,52.74 v23.62,51.9 23.02,51.03 22.46,50.12 21.96,49.19 21.5,48.24 21.09,47.26 20.74,46.26 20.44,45.24 20.19,44.21 20,43.17 19.86,42.12 19.78,41.06 19.75,40 19.78,38.94 19.86,37.88 20,36.83 v20.19,35.79 20.44,34.76 20.74,33.74 21.09,32.74 21.5,31.76 21.96,30.81 22.46,29.88 23.02,28.97 23.62,28.1 24.26,27.26 24.95,26.45 25.68,25.68 26.45,24.95 27.26,24.26 28.1,23.62 28.97,23.02 v29.88,22.46 30.81,21.96 31.76,21.5 32.74,21.09 33.74,20.74 34.76,20.44 35.79,20.19 36.83,20 37.88,19.86 38.94,19.78 40,19.75 41.06,19.78 42.12,19.86 v43.17,20 44.21,20.19 45.24,20.44 v46.26,20.74 47.26,21.09 48.24,21.5 49.19,21.96 50.12,22.46 51.03,23.02 51.9,23.62 52.74,24.26 53.55,24.95 54.32,25.68 55.05,26.45 55.74,27.26 56.38,28.1 56.98,28.97 57.54,29.88 58.04,30.81 58.5,31.76 58.91,32.74 59.26,33.74 59.56,34.76 59.81,35.79 v60,36.83 60.14,37.88 60.22,38.94 60.25,40 60.22,41.06 60.14,42.12 60,43.17 59.81,44.21 59.56,45.24 59.26,46.26 58.91,47.26 58.5,48.24 58.04,49.19 v57.54,50.12 56.98,51.03 56.38,51.9 55.74,52.74 55.05,53.55 54.32,54.32 53.55,55.05 52.74,55.74 51.9,56.38 51.03,56.98 50.12,57.54 49.19,58.04 48.24,58.5 47.26,58.91 46.26,59.26 45.24,59.56 44.21,59.81 LED_1_3.C | v42.58,23.7 43.43,23.86 44.27,24.06 45.1,24.31 45.91,24.6 46.71,24.93 47.49,25.3 48.25,25.71 48.99,26.16 49.7,26.65 50.38,27.18 51.04,27.74 51.67,28.33 52.26,28.96 52.82,29.62 53.35,30.3 53.84,31.01 54.29,31.75 54.7,32.51 55.07,33.29 51.42,34.92 51.28,35.03 51.1,35.2 RN3.2
  Top 0.381: 73.83,34.64 75.56,34.37 75.8,36.24 75.95,38.12 76,40 75.95,41.88 75.8,43.76 75.56,45.63 75.21,47.48 74.77,49.32 74.24,51.12 73.61,52.9 72.89,54.64 72.08,56.34 73.41,57.02 73.36,57.2 LED_8_3.C | 73.83,34.64 v68.64,35.46 | LED_3_1.A | LED_3_1.A 73.5,32.89 | 73.5,32.89 73.83,34.64 | LED_3_9.A 61.16,10.88 59.61,9.81 58,8.82 56.34,7.92 54.64,7.11 52.9,6.39 51.12,5.76 49.32,5.23 47.48,4.79 45.63,4.44 43.76,4.2 41.88,4.05 40,4 38.12,4.05 38.04,2.55 38.2,2.52 38.23,2.52 LED_9_3.C | LED_2_3.C v65.11,54.5 | LED_4_3.C | LED_4_3.C | LED_4_3.C v48.96,12.42 | LED_5_3.C v25.5,14.88 | LED_6_3.C | LED_6_3.C 9.94,33.61 | 9.94,33.61 v11.63,33.97 | LED_7_3.C | LED_7_3.C | LED_7_3.C v16.54,57.05 | LED_6_3.C 9.93,33.63 9.94,33.61 | LED_4_3.C | LED_7_3.C 15.14,58.09 LED_7_3.C | LED_3_1.A 73.51,32.89 73.5,32.89 | LED_3_9.A | LED_3_9.A | LED_3_8.A | LED_3_8.A | LED_3_7.A | 65.46,17.09 LED_3_7.A | LED_3_6.A | LED_3_6.A | LED_3_2.A | 72.59,29.44 LED_3_2.A | LED_2_3.C | 66.65,55.37 LED_2_3.C
  Bottom 0.381: v65.11,54.5 v57.54,50.12 | v48.96,12.42 v46.26,20.74 | v25.5,14.88 v29.88,22.46 | v11.63,33.97 v20.19,35.79 | v16.54,57.05 v23.62,51.9 | v68.64,35.46 v60,36.83 | v42.58,23.7 v43.17,20
N_4  (via drill 0.64)
  Top 0.381: LED_4_1.A LED_4_2.A | LED_4_2.A | LED_4_2.A | LED_4_2.A LED_4_3.A | LED_4_3.A LED_4_5.A LED_4_6.A | LED_4_6.A LED_4_7.A LED_4_8.A | LED_4_8.A LED_4_9.A | 36.64,61.23 35.53,61.03 34.44,60.77 33.36,60.45 32.3,60.07 31.25,59.64 30.24,59.16 29.25,58.62 28.29,58.03 27.36,57.39 26.47,56.71 25.61,55.98 24.8,55.2 v24.02,54.39 23.29,53.53 22.61,52.64 21.97,51.71 21.38,50.75 20.84,49.76 20.36,48.74 19.93,47.7 19.55,46.64 19.23,45.56 18.97,44.47 18.77,43.36 18.62,42.25 18.53,41.12 18.5,40 18.53,38.88 v18.62,37.75 18.77,36.64 18.97,35.53 19.23,34.44 19.55,33.36 19.93,32.3 20.36,31.25 20.84,30.24 21.38,29.25 21.97,28.29 22.61,27.36 23.29,26.47 24.02,25.61 24.8,24.8 25.61,24.02 26.47,23.29 v27.36,22.61 28.29,21.97 29.25,21.38 30.24,20.84 31.25,20.36 32.3,19.93 33.36,19.55 v34.44,19.23 35.53,18.97 36.64,18.77 37.75,18.62 38.88,18.53 40,18.5 v41.12,18.53 42.25,18.62 43.36,18.77 44.47,18.97 45.56,19.23 46.64,19.55 47.7,19.93 48.74,20.36 49.76,20.84 50.75,21.38 51.71,21.97 52.64,22.61 53.53,23.29 54.39,24.02 55.2,24.8 55.98,25.61 56.71,26.47 57.39,27.36 58.03,28.29 58.62,29.25 59.16,30.24 v59.64,31.25 60.07,32.3 60.45,33.36 60.77,34.44 61.03,35.53 61.23,36.64 61.38,37.75 61.47,38.88 61.5,40 61.47,41.12 61.38,42.25 61.23,43.36 61.03,44.47 60.77,45.56 60.45,46.64 60.07,47.7 v59.64,48.74 59.16,49.76 58.62,50.75 58.03,51.71 57.39,52.64 56.71,53.53 55.98,54.39 55.2,55.2 54.39,55.98 53.53,56.71 52.64,57.39 51.71,58.03 50.75,58.62 49.76,59.16 48.74,59.64 47.7,60.07 46.64,60.45 LED_1_4.C | v40.8,24.77 41.56,24.83 42.32,24.93 43.07,25.06 43.82,25.24 44.55,25.45 45.28,25.69 45.99,25.98 46.69,26.29 45.48,28.77 45.44,28.96 45.44,29.18 RN4.2
  Top 0.381: 31.14,6.92 30.68,5.23 28.88,5.76 27.1,6.39 25.36,7.11 23.66,7.92 22,8.82 20.39,9.81 19.58,8.55 19.71,8.41 LED_9_4.C | 31.14,6.92 31.18,7.09 | 31.18,7.09 v32.49,11.99 | 31.14,6.92 LED_4_9.A | v75.01,26.56 75.67,28.41 76.22,30.29 76.68,32.2 77.04,34.13 77.3,36.08 77.45,38.04 77.5,38.2 77.5,38.23 LED_8_4.C | v67.07,29.61 v66.49,28.2 LED_3_4.C | LED_2_4.C v66.49,51.8 | LED_5_4.C | LED_5_4.C 21.94,15.14 | 21.94,15.14 v22.95,16.54 | LED_6_4.C | LED_6_4.C | LED_6_4.C v11.16,36.97 | LED_7_4.C v18.45,59.41 | 31.18,7.09 31.11,7.11 31.14,6.92 | LED_5_4.C 21.95,15.14 21.94,15.14 | LED_4_9.A | 32.89,6.5 LED_4_9.A | LED_4_8.A | LED_4_8.A | LED_6_4.C | LED_4_6.A | LED_4_6.A | LED_4_3.A | 50.6,7.44 LED_4_3.A | LED_4_2.A | LED_7_4.C | LED_7_4.C | LED_2_4.C | LED_2_4.C
  Bottom 0.381: v66.49,51.8 v59.64,48.74 | v66.49,28.2 v59.64,31.25 | v22.95,16.54 v27.36,22.61 | v11.16,36.97 v18.62,37.75 | v18.45,59.41 v24.02,54.39 | v32.49,11.99 v34.44,19.23 | v75.01,26.56 v67.07,29.61 | v40.8,24.77 v41.12,18.53
N_5  (via drill 0.64)
  Top 0.381: LED_5_1.A LED_5_2.A | LED_5_2.A LED_5_3.A | LED_5_3.A LED_5_4.A | LED_5_4.A | LED_5_4.A | LED_5_4.A LED_5_6.A | LED_5_6.A LED_5_7.A | LED_5_7.A | LED_5_7.A LED_5_8.A | LED_5_8.A LED_5_9.A | 36.44,62.47 35.27,62.25 34.11,61.98 v32.97,61.64 31.85,61.24 30.75,60.78 29.67,60.27 28.62,59.7 27.61,59.08 26.63,58.41 25.68,57.68 v24.78,56.91 23.91,56.09 23.09,55.22 22.32,54.32 21.59,53.37 20.92,52.39 20.3,51.38 19.73,50.33 19.22,49.25 18.76,48.15 18.36,47.03 18.02,45.89 17.75,44.73 17.53,43.56 17.38,42.38 17.28,41.19 v17.25,40 17.28,38.81 17.38,37.62 17.53,36.44 17.75,35.27 18.02,34.11 18.36,32.97 18.76,31.85 19.22,30.75 v19.73,29.67 20.3,28.62 20.92,27.61 21.59,26.63 22.32,25.68 23.09,24.78 23.91,23.91 24.78,23.09 25.68,22.32 26.63,21.59 27.61,20.92 28.62,20.3 29.67,19.73 30.75,19.22 31.85,18.76 32.97,18.36 34.11,18.02 35.27,17.75 36.44,17.53 37.62,17.38 v38.81,17.28 40,17.25 41.19,17.28 42.38,17.38 43.56,17.53 v44.73,17.75 45.89,18.02 47.03,18.36 48.15,18.76 49.25,19.22 50.33,19.73 51.38,20.3 52.39,20.92 53.37,21.59 54.32,22.32 55.22,23.09 56.09,23.91 56.91,24.78 57.68,25.68 58.41,26.63 59.08,27.61 v59.7,28.62 60.27,29.67 60.78,30.75 61.24,31.85 61.64,32.97 61.98,34.11 62.25,35.27 62.47,36.44 62.62,37.62 62.72,38.81 62.75,40 62.72,41.19 62.62,42.38 62.47,43.56 62.25,44.73 61.98,45.89 v61.64,47.03 61.24,48.15 60.78,49.25 60.27,50.33 59.7,51.38 59.08,52.39 58.41,53.37 57.68,54.32 56.91,55.22 56.09,56.09 55.22,56.91 54.32,57.68 53.37,58.41 52.39,59.08 51.38,59.7 50.33,60.27 49.25,60.78 LED_1_5.C | v39.2,24.77 38.44,24.83 37.68,24.93 36.93,25.06 36.18,25.24 35.45,25.45 34.72,25.69 34.01,25.98 33.31,26.29 34.52,28.77 34.57,28.93 34.57,29.18 RN5.2
  Top 0.381: 9.48,24.45 6.59,22.98 6.63,22.78 LED_9_5.C | 9.48,24.45 v14.16,26.83 | 9.48,24.45 LED_5_9.A | LED_5_9.A | LED_5_9.A | LED_2_5.C v67.58,48.96 | LED_3_5.C v65.11,25.5 | LED_4_5.C | LED_4_5.C | LED_4_5.C v46.03,11.63 | LED_6_5.C v11,40 | LED_7_5.C v20.59,61.55 | LED_8_5.C v31.04,67.58 | LED_5_9.A | LED_5_8.A | LED_5_8.A | LED_5_7.A 14.55,17.09 LED_5_7.A | LED_5_6.A | 17.09,14.55 LED_5_6.A | LED_5_4.A | LED_5_3.A | LED_5_3.A | LED_5_2.A | 26.09,8.71 LED_5_2.A | LED_4_5.C 46.41,9.93 LED_4_5.C | LED_7_5.C | 19.41,62.87 LED_7_5.C | LED_3_5.C | 66.65,24.64 LED_3_5.C | LED_8_5.C | 30.5,69.27 LED_8_5.C | LED_1_5.C | LED_1_5.C
  Bottom 0.381: v67.58,48.96 v61.64,47.03 | v65.11,25.5 v59.7,28.62 | v46.03,11.63 v44.73,17.75 | v11,40 v17.25,40 | v20.59,61.55 v24.78,56.91 | v31.04,67.58 v32.97,61.64 | v14.16,26.83 v19.73,29.67 | v39.2,24.77 v38.81,17.28
N_6  (via drill 0.64)
  Top 0.381: LED_6_1.A LED_6_2.A | LED_6_2.A | LED_6_2.A 7.42,29.43 | 7.42,29.43 LED_6_3.A | LED_6_3.A | LED_6_3.A 6.5,32.89 | 6.5,32.89 LED_6_4.A | LED_6_4.A | LED_6_4.A | LED_6_4.A LED_6_5.A LED_6_7.A | LED_6_7.A | LED_6_7.A | LED_6_7.A LED_6_8.A LED_6_9.A | 36.25,63.7 v35.01,63.48 33.79,63.18 32.58,62.83 31.4,62.41 30.24,61.92 29.1,61.38 28,60.78 26.93,60.13 v25.89,59.42 24.9,58.65 23.94,57.84 23.03,56.97 22.16,56.06 21.35,55.1 20.58,54.11 19.87,53.07 19.21,52 18.62,50.9 18.07,49.76 v17.59,48.6 17.18,47.42 16.82,46.21 16.52,44.99 16.3,43.75 16.13,42.51 16.03,41.26 16,40 16.03,38.74 16.13,37.49 16.3,36.25 16.52,35.01 16.82,33.79 17.18,32.58 17.59,31.4 18.07,30.24 18.62,29.1 19.21,28 19.87,26.93 20.58,25.89 21.35,24.9 22.16,23.94 23.03,23.03 v23.94,22.16 24.9,21.35 25.89,20.58 26.93,19.87 28,19.21 29.1,18.62 30.24,18.07 31.4,17.59 32.58,17.18 33.79,16.82 35.01,16.52 v36.25,16.3 37.49,16.13 38.74,16.03 40,16 41.26,16.03 v42.51,16.13 43.75,16.3 44.99,16.52 46.21,16.82 47.42,17.18 48.6,17.59 49.76,18.07 50.9,18.62 52,19.21 53.07,19.87 54.11,20.58 55.1,21.35 56.06,22.16 56.97,23.03 57.84,23.94 58.65,24.9 v59.42,25.89 60.13,26.93 60.78,28 61.38,29.1 61.92,30.24 62.41,31.4 62.83,32.58 63.18,33.79 63.48,35.01 63.7,36.25 63.87,37.49 63.97,38.74 64,40 63.97,41.26 63.87,42.51 63.7,43.75 v63.48,44.99 63.18,46.21 62.83,47.42 62.41,48.6 61.92,49.76 61.38,50.9 60.78,52 60.13,53.07 59.42,54.11 58.65,55.1 57.84,56.06 56.97,56.97 56.06,57.84 55.1,58.65 54.11,59.42 53.07,60.13 52,60.78 LED_1_6.C | LED_1_6.C | LED_1_6.C | v37.42,23.7 36.57,23.86 35.73,24.06 34.9,24.31 34.09,24.6 33.29,24.93 32.51,25.3 31.75,25.71 31.01,26.16 30.3,26.65 29.62,27.18 28.96,27.74 28.33,28.33 27.74,28.96 27.18,29.62 26.65,30.3 26.16,31.01 25.71,31.75 25.3,32.51 24.93,33.29 28.58,34.92 28.73,35.03 RN6.2
  Top 0.381: 8.03,52.27 4.99,53.44 4.33,51.59 3.78,49.71 3.32,47.8 2.96,45.87 2.71,43.92 2.55,41.96 2.49,41.78 2.49,41.76 LED_9_6.C | 8.03,52.27 v12.93,50.39 | 8.03,52.27 7.43,50.6 | 7.43,50.6 LED_6_9.A | LED_6_9.A | LED_2_6.C v68.37,46.03 | LED_3_6.C | LED_3_6.C | LED_3_6.C v63.46,22.95 | LED_4_6.C | LED_4_6.C | LED_4_6.C v43.03,11.16 | LED_5_6.C v20.59,18.45 | LED_7_6.C | LED_7_6.C | LED_7_6.C v22.95,63.46 | LED_8_6.C v33.97,68.37 | LED_6_2.A 7.44,29.44 7.42,29.43 | LED_4_6.C | LED_6_3.A 6.5,32.89 | LED_6_4.A | LED_6_7.A | LED_6_9.A 7.44,50.6 7.43,50.6 | LED_7_6.C | LED_3_6.C | LED_8_6.C | LED_8_6.C | LED_1_6.C | LED_1_6.C
  Bottom 0.381: v68.37,46.03 v63.48,44.99 | v63.46,22.95 v59.42,25.89 | v43.03,11.16 v42.51,16.13 | v20.59,18.45 v23.94,22.16 | v22.95,63.46 v25.89,59.42 | v33.97,68.37 v35.01,63.48 | v12.93,50.39 v17.59,48.6 | v37.42,23.7 v36.25,16.3
N_7  (via drill 0.64)
  Top 0.381: LED_7_1.A LED_7_2.A | LED_7_2.A | LED_7_2.A | LED_7_2.A 12.28,60.11 | 12.28,60.11 LED_7_3.A | LED_7_3.A | LED_7_3.A LED_7_4.A | LED_7_4.A LED_7_5.A | LED_7_5.A 18.51,66.61 | 18.51,66.61 LED_7_6.A | LED_7_6.A LED_7_8.A LED_7_9.A | LED_1_7.C 54.84,60.43 55.89,59.62 56.9,58.76 57.85,57.85 58.76,56.9 59.62,55.89 60.43,54.84 61.18,53.75 61.87,52.62 62.5,51.46 63.07,50.27 63.57,49.05 64.01,47.8 64.39,46.53 64.7,45.25 64.94,43.95 v65.11,42.64 65.22,41.32 65.25,40 65.22,38.68 65.11,37.36 64.94,36.05 64.7,34.75 64.39,33.47 64.01,32.2 63.57,30.95 63.07,29.73 62.5,28.54 61.87,27.38 61.18,26.25 60.43,25.16 59.62,24.11 v58.76,23.1 57.85,22.15 56.9,21.24 55.89,20.38 54.84,19.57 53.75,18.82 52.62,18.13 51.46,17.5 50.27,16.93 49.05,16.43 47.8,15.99 46.53,15.61 45.25,15.3 43.95,15.06 42.64,14.89 41.32,14.79 v40,14.75 38.68,14.79 37.36,14.89 36.05,15.06 34.75,15.3 33.47,15.61 32.2,15.99 30.95,16.43 29.73,16.93 28.54,17.5 27.38,18.13 26.25,18.82 25.16,19.57 24.11,20.38 23.1,21.24 22.15,22.15 v21.24,23.1 20.38,24.11 19.57,25.16 18.82,26.25 18.13,27.38 17.5,28.54 16.93,29.73 16.43,30.95 15.99,32.2 15.61,33.47 15.3,34.75 15.06,36.05 14.89,37.36 14.79,38.68 14.75,40 14.79,41.32 v14.89,42.64 15.06,43.95 15.3,45.25 15.61,46.53 15.99,47.8 16.43,49.05 16.93,50.27 17.5,51.46 18.13,52.62 18.82,53.75 19.57,54.84 20.38,55.89 21.24,56.9 22.15,57.85 23.1,58.76 v24.11,59.62 25.16,60.43 26.25,61.18 27.38,61.87 28.54,62.5 29.73,63.07 30.95,63.57 32.2,64.01 33.47,64.39 34.75,64.7 36.05,64.94 v37.36,65.11 38.27,56.41 37.43,56.3 36.59,56.14 35.76,55.95 34.94,55.71 34.14,55.42 33.35,55.1 32.58,54.73 31.82,54.33 31.09,53.89 30.39,53.41 29.71,52.9 29.05,52.35 28.43,51.77 27.84,51.15 27.28,50.51 26.75,49.84 26.26,49.14 25.81,48.42 25.39,47.67 25.02,46.91 24.68,46.12 24.38,45.32 24.13,44.51 23.92,43.68 23.75,42.84 23.62,42 23.54,41.15 27.53,40.87 27.64,40.72 27.91,40.72 RN7.2
  Top 0.381: 18.48,66.57 16.4,69.14 14.91,67.87 13.48,66.52 12.13,65.09 10.86,63.6 9.66,62.04 8.55,60.42 8.41,60.3 LED_9_7.C | 18.48,66.57 v21.75,62.54 | LED_2_7.C v68.84,43.03 | LED_3_7.C v61.55,20.59 | LED_4_7.C v40,11 | LED_5_7.C v18.45,20.59 | LED_6_7.C | LED_6_7.C | LED_6_7.C v11.16,43.03 | LED_8_7.C v36.97,68.84 | LED_7_2.A | 12.28,60.11 12.27,60.12 LED_7_3.A | LED_7_4.A | LED_7_4.A | LED_7_5.A | 17.09,65.46 LED_7_5.A | LED_7_6.A | LED_7_6.A | LED_6_7.C | LED_3_7.C | 62.87,19.43 LED_3_7.C | LED_8_7.C | LED_8_7.C | 18.51,66.61 18.52,66.6 18.48,66.57
  Bottom 0.381: v68.84,43.03 v65.11,42.64 | v61.55,20.59 v58.76,23.1 | v40,11 v40,14.75 | v18.45,20.59 v21.24,23.1 | v11.16,43.03 v14.89,42.64 | v36.97,68.84 v37.36,65.11 | v21.75,62.54 v24.11,59.62
N_8  (via drill 0.64)
  Top 0.381: LED_8_5.A LED_8_6.A | LED_8_6.A LED_8_7.A 38.2,74.16 | 38.2,74.16 LED_8_9.A | LED_1_8.C 57.73,59.69 58.74,58.74 59.69,57.73 60.59,56.68 61.44,55.58 62.23,54.43 62.95,53.25 63.61,52.03 64.21,50.78 64.74,49.5 65.2,48.19 65.6,46.86 65.92,45.51 66.17,44.15 66.36,42.77 66.46,41.39 v66.5,40 66.46,38.61 66.36,37.23 66.17,35.85 65.92,34.49 65.6,33.14 65.2,31.81 64.74,30.5 64.21,29.22 63.61,27.97 62.95,26.75 62.23,25.57 61.44,24.42 60.59,23.32 59.69,22.27 58.74,21.26 v57.73,20.31 56.68,19.41 55.58,18.56 54.43,17.77 53.25,17.05 52.03,16.39 50.78,15.79 49.5,15.26 48.19,14.8 46.86,14.4 45.51,14.08 44.15,13.83 42.77,13.64 41.39,13.54 40,13.5 38.61,13.54 v37.23,13.64 35.85,13.83 34.49,14.08 33.14,14.4 31.81,14.8 30.5,15.26 29.22,15.79 27.97,16.39 26.75,17.05 25.57,17.77 24.42,18.56 23.32,19.41 22.27,20.31 21.26,21.26 20.31,22.27 19.41,23.32 v18.56,24.42 17.77,25.57 17.05,26.75 16.39,27.97 15.79,29.22 15.26,30.5 14.8,31.81 14.4,33.14 14.08,34.49 13.83,35.85 13.64,37.23 13.54,38.61 13.5,40 13.54,41.39 13.64,42.77 13.83,44.15 v14.08,45.51 14.4,46.86 14.8,48.19 15.26,49.5 15.79,50.78 16.39,52.03 17.05,53.25 17.77,54.43 18.56,55.58 19.41,56.68 20.31,57.73 21.26,58.74 22.27,59.69 23.32,60.59 24.42,61.44 25.57,62.23 v26.75,62.95 27.97,63.61 29.22,64.21 30.5,64.74 31.81,65.2 33.14,65.6 34.49,65.92 35.85,66.17 37.23,66.36 v38.61,66.46 39.2,55.23 38.44,55.17 37.69,55.07 36.93,54.94 36.19,54.77 35.46,54.56 34.73,54.31 34.02,54.03 33.33,53.71 32.65,53.36 31.99,52.98 31.36,52.56 30.74,52.12 30.14,51.64 29.57,51.13 29.03,50.59 31.01,48.68 30.99,48.51 31.19,48.31 RN8.2
  Top 0.381: 72.71,61.24 73.78,59.5 74.75,57.71 75.63,55.86 76.41,53.98 77.09,52.05 77.67,50.09 78.15,48.11 78.52,46.1 78.79,44.08 78.95,42.04 77.49,41.97 | 72.71,61.24 71.55,62.92 70.31,64.54 68.98,66.1 67.58,67.58 66.1,68.98 64.54,70.31 62.92,71.55 61.24,72.71 59.5,73.78 57.71,74.75 | 57.71,74.75 55.86,75.63 53.98,76.41 52.05,77.09 50.09,77.67 48.11,78.15 46.1,78.52 44.08,78.79 42.04,78.95 40,79 37.96,78.95 | 37.96,78.95 35.92,78.79 33.9,78.52 31.89,78.15 29.91,77.67 27.95,77.09 26.02,76.41 24.14,75.63 22.29,74.75 22.95,73.47 | 77.49,41.97 77.45,41.96 | 72.71,61.24 71.5,60.46 | 71.5,60.46 71.45,60.42 | 57.71,74.75 57.04,73.44 | 57.04,73.44 57.02,73.41 | 37.96,78.95 38.04,77.45 | 22.95,73.47 22.98,73.41 | 38.04,77.45 v38.21,74.2 38.2,74.22 38.2,74.16 | LED_2_8.C v69,40 | LED_3_8.C v59.41,18.45 | LED_4_8.C | LED_4_8.C | LED_4_8.C v36.97,11.16 | LED_5_8.C | LED_5_8.C | LED_5_8.C v16.54,22.95 | LED_6_8.C | LED_6_8.C | LED_6_8.C v11.63,46.03 | LED_7_8.C | LED_7_8.C | LED_7_8.C v25.5,65.11 | LED_4_8.C | LED_3_8.C | LED_3_8.C | LED_5_8.C 15.14,21.92 LED_5_8.C | LED_6_8.C 9.93,46.41 LED_6_8.C | LED_7_8.C 24.64,66.62 LED_7_8.C | LED_9_8.C 22.78,73.36 22.78,73.38 22.95,73.47 | LED_8_6.A | 32.89,73.51 LED_8_6.A | LED_8_1.A 38.23,77.52 38.2,77.52 38.04,77.45 | LED_8_4.A 77.5,41.78 77.49,41.97 | LED_1_8.C | 60.58,62.87 LED_1_8.C | LED_8_2.A 57.2,73.36 57.04,73.44 | LED_8_3.A 71.6,60.3 71.5,60.46
  Bottom 0.381: v69,40 v66.5,40 | v59.41,18.45 v57.73,20.31 | v36.97,11.16 v37.23,13.64 | v16.54,22.95 v18.56,24.42 | v11.63,46.03 v14.08,45.51 | v25.5,65.11 v26.75,62.95 | v38.21,74.2 v38.61,66.46
N_9
  Top 0.381: 40,67.75 38.55,67.71 37.1,67.6 35.66,67.41 34.23,67.14 32.82,66.8 31.43,66.39 30.05,65.91 | 30.05,65.91 28.71,65.35 | 28.71,65.35 27.4,64.72 26.12,64.03 24.89,63.27 23.69,62.45 22.54,61.57 21.43,60.62 20.38,59.62 19.38,58.57 18.43,57.46 17.55,56.31 16.73,55.11 15.97,53.88 15.28,52.6 14.65,51.29 14.09,49.95 13.61,48.58 | 13.61,48.58 13.2,47.18 12.86,45.77 12.59,44.34 12.4,42.9 12.29,41.45 12.25,40 12.29,38.55 12.4,37.1 12.59,35.66 12.86,34.23 13.2,32.82 13.61,31.43 14.09,30.05 14.65,28.71 15.28,27.4 15.97,26.12 | 15.97,26.12 16.73,24.89 17.55,23.69 18.43,22.54 19.38,21.43 20.38,20.38 21.43,19.38 22.54,18.43 23.69,17.55 24.89,16.73 26.12,15.97 27.4,15.28 28.71,14.65 30.05,14.09 31.43,13.61 32.82,13.2 34.23,12.86 | 34.23,12.86 35.66,12.59 37.1,12.4 38.55,12.29 40,12.25 41.45,12.29 42.9,12.4 44.34,12.59 45.77,12.86 47.18,13.2 48.58,13.61 49.95,14.09 51.29,14.65 52.6,15.28 53.88,15.97 55.11,16.73 56.31,17.55 | 56.31,17.55 57.46,18.43 58.57,19.38 59.62,20.38 60.62,21.43 61.57,22.54 62.45,23.69 63.27,24.89 64.03,26.12 64.72,27.4 65.35,28.71 65.91,30.05 66.39,31.43 66.8,32.82 67.14,34.23 67.41,35.66 67.6,37.1 | 67.6,37.1 67.71,38.55 67.75,40 67.71,41.45 67.6,42.9 67.41,44.34 67.14,45.77 66.8,47.18 66.39,48.58 65.91,49.95 65.35,51.29 64.72,52.6 64.03,53.88 63.27,55.11 62.45,56.31 61.57,57.46 60.62,58.57 LED_1_9.C | 40,67.56 40,53.5 40.01,53.42 RN9.2 | 40,67.56 40,67.75 | 40,67.75 LED_8_9.C | 5.25,57.71 6.22,59.5 7.29,61.24 8.45,62.92 9.69,64.54 11.02,66.1 12.42,67.58 13.9,68.98 15.46,70.31 17.08,71.55 18.76,72.71 19.56,71.48
  Top 0.381: 5.25,57.71 4.37,55.86 3.59,53.98 2.91,52.05 2.33,50.09 1.85,48.11 1.48,46.1 1.21,44.08 1.05,42.04 1,40 1.05,37.96 | 1.05,37.96 1.21,35.92 1.48,33.9 1.85,31.89 2.33,29.91 2.91,27.95 3.59,26.02 4.37,24.14 5.25,22.29 6.22,20.5 7.29,18.76 | 7.29,18.76 8.45,17.08 9.69,15.46 11.02,13.9 12.42,12.42 13.9,11.02 15.46,9.69 17.08,8.45 18.76,7.29 20.5,6.22 22.29,5.25 | 22.29,5.25 24.14,4.37 26.02,3.59 27.95,2.91 29.91,2.33 31.89,1.85 33.9,1.48 35.92,1.21 37.96,1.05 40,1 42.04,1.05 | 42.04,1.05 44.08,1.21 46.1,1.48 48.11,1.85 50.09,2.33 52.05,2.91 53.98,3.59 55.86,4.37 57.71,5.25 59.5,6.22 61.24,7.29 | 61.24,7.29 62.92,8.45 64.54,9.69 66.1,11.02 67.58,12.42 68.98,13.9 70.31,15.46 71.55,17.08 72.71,18.76 73.78,20.5 74.75,22.29 73.43,22.96 | 19.56,71.48 19.58,71.45 20.39,70.19 22,71.18 23.66,72.08 25.36,72.89 27.1,73.61 30.05,65.91 | 5.25,57.71 6.57,57.03 | 6.57,57.03 6.59,57.02 | 1.05,37.96 2.5,38.03 | 2.5,38.03 2.55,38.04 | 7.29,18.76 8.51,19.55 | 8.51,19.55 8.55,19.58 | 22.29,5.25 22.95,6.54 | 22.95,6.54 22.98,6.59 | 42.04,1.05 41.96,2.52 | 41.96,2.52 41.96,2.55 | 61.24,7.29 60.43,8.54 | 60.43,8.54 60.42,8.55 | 73.43,22.96 73.41,22.98 | LED_2_9.C | LED_2_9.C 70.56,36.79 | 70.56,36.79 67.6,37.1 | LED_3_9.C | LED_3_9.C 58.06,15.14 | 58.06,15.14 56.31,17.55 | LED_4_9.C | LED_4_9.C | LED_4_9.C 34.23,12.86 | LED_5_9.C 15.97,26.12 | LED_6_9.C | LED_6_9.C | LED_6_9.C 13.61,48.58 | LED_7_9.C 28.71,65.35 | LED_9_5.A 8.41,19.71 8.51,19.55 | 70.56,36.79 70.56,36.8 LED_2_9.C | LED_9_4.A 22.78,6.63 22.95,6.54 | LED_9_6.A 2.49,38.23 2.49,38.2 2.5,38.03 | LED_9_3.A 41.76,2.52 41.78,2.52 41.96,2.52 | LED_4_9.C | LED_6_9.C
  Top 0.381: LED_9_7.A 6.66,57.2 6.57,57.03 | LED_9_2.A 60.27,8.43 60.43,8.54 | LED_3_9.C 58.06,15.14 | LED_9_8.A 19.71,71.58 19.56,71.48 | LED_9_1.A 73.36,22.78 73.36,22.81 73.43,22.96 | LED_1_9.C | 62.87,60.58 LED_1_9.C | 40,67.56 40.01,67.56 40,67.75
PA0
  Top 0.381: RN1.1 46.66,50.09 46.66,48.21 49.84,45.03 52.55,45.03 53.21,44.37 53.21,42.57 52.91,42.27 52.7,42.27 52.65,42.22 52.4,42.22 52.35,42.16 52.12,42.16 52.07,42.11 51.84,42.11 51.79,42.06 51.54,42.06 51.49,42.01 51.26,42.01 51.21,41.96 50.98,41.96 50.93,41.91 50.75,41.91 48.59,39.75 48.59,35.31 47.62,34.34 44.63,34.34 42.55,36.42 IC1.13
PA1
  Top 0.381: RN2.1 48.74,43.46 44.37,39.09 42.01,39.09 41.27,38.35 41.27,37.41 IC1.12
PA2
  Top 0.381: RN3.1 43.64,32.79 40.01,36.42 IC1.11
PA3
  Top 0.381: RN4.1 42.77,28.27 42.77,32.38 38.73,36.42 IC1.10
PA4
  Top 0.381: RN5.1 37.24,28.27 37.24,29.23 39.98,31.98 SCL.TP 39.93,32.18 37.47,34.65 IC1.9
PA5
  Top 0.381: RN6.1 30.33,32.79 30.33,33.25 MISO.TP 33.25,36.07 34.57,37.39 36.17,37.39 IC1.8
PA6
  Top 0.381: RN7.1 28.45,43.48 32.56,43.48 MOSI.TP 33.25,43.89 34.52,42.62 36.17,42.62 IC1.7
PA7
  Top 0.381: RN8.1 33.38,50.09 33.38,47.65 37.44,43.59 37.44,42.62 IC1.6
PB0  (via drill 0.64)
  Top 0.381: v42.55,44.58 42.55,42.62 IC1.2
  pour Bottom (isolate 0.6): 40.89,56.98 40.89,23.02 41.78,23.09 42.66,23.21 43.53,23.37 44.4,23.58 45.25,23.83 46.09,24.13 46.91,24.47 47.72,24.85 48.5,25.28 49.26,25.74 49.99,26.25 50.7,26.79 51.38,27.37 52.02,27.98 52.63,28.62 53.21,29.3 53.75,30.01 54.26,30.74 54.72,31.5 55.15,32.28 55.53,33.09 55.87,33.91 56.17,34.75 56.42,35.6 56.63,36.47 56.79,37.34 56.91,38.22 56.98,39.11 57,40 56.98,40.89 56.91,41.78 56.79,42.66 56.63,43.53 56.42,44.4 56.17,45.25 55.87,46.09 55.53,46.91 55.15,47.72 54.72,48.5 54.26,49.26 53.75,49.99 53.21,50.7 52.63,51.38 52.02,52.02 51.38,52.63 50.7,53.21 49.99,53.75 49.26,54.26 48.5,54.72 47.72,55.15 46.91,55.53 46.09,55.87 45.25,56.17 44.4,56.42 43.53,56.63 42.66,56.79 41.78,56.91
PB1  (via drill 0.64)
  Top 0.381: 41.25,41.63 41.25,42.6 IC1.3 41.25,42.8 41.25,45.49 v41.23,45.49
  Bottom 0.381: v41.22,45.49 v41.23,45.49 41.02,45.49 39.11,45.49
  pour Bottom (isolate 0.6): 39.11,23.02 39.11,56.98 38.22,56.91 37.34,56.79 36.47,56.63 35.6,56.42 34.75,56.17 33.91,55.87 33.09,55.53 32.28,55.15 31.5,54.72 30.74,54.26 30.01,53.75 29.3,53.21 28.62,52.63 27.98,52.02 27.37,51.38 26.79,50.7 26.25,49.99 25.74,49.26 25.28,48.5 24.85,47.72 24.47,46.91 24.13,46.09 23.83,45.25 23.58,44.4 23.37,43.53 23.21,42.66 23.09,41.78 23.02,40.89 23,40 23.02,39.11 23.09,38.22 23.21,37.34 23.37,36.47 23.58,35.6 23.83,34.75 24.13,33.91 24.47,33.09 24.85,32.28 25.28,31.5 25.74,30.74 26.25,30.01 26.79,29.3 27.37,28.62 27.98,27.98 28.62,27.37 29.3,26.79 30.01,26.25 30.74,25.74 31.5,25.28 32.28,24.85 33.09,24.47 33.91,24.13 34.75,23.83 35.6,23.58 36.47,23.37 37.34,23.21 38.22,23.09
PB2
  Top 0.381: RN9.1 39.98,50.6 39.98,50.32 38.33,48.67 38.33,43.97 38.71,43.59 38.71,42.62 IC1.5
PB3
  Top 0.381: IC1.4 40.01,42.62 40.01,47.98 RESET.TP
  Bottom 0.381: 39.85,47.98 39.98,47.98 RESET.TP 40.08,48.18 40.08,50.83 RDOWN.1 40.13,51 39.85,51.28 39.85,53.98 RUP.1
VCC  (2 unrouted)
  Top 0.381: 43.81,42.62 IC1.1 44.02,42.65 45.57,42.65 46.91,43.99 VCC.TP